# Altium schematic sheet MEZ_ALL_IND.SchDoc
size A4
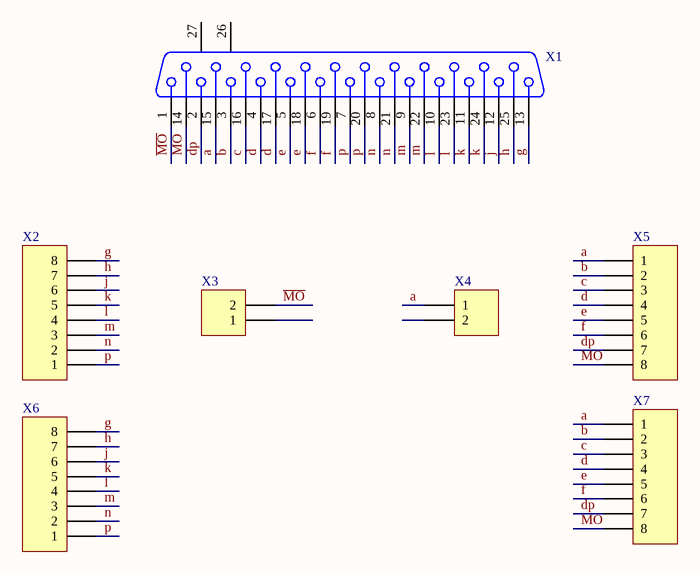
[diagram p0: MEZ_ALL_IND.SchDoc]

## Parts
X1  D Connector 25  [DSUB1.385-2H25A]  (value not drawn)
X2  Header 8  [HDR1X8]  (value not drawn)
X3  Header 2  [HDR1X2]  (value not drawn)
X4  Header 2  [HDR1X2]  (value not drawn)
X5  Header 8  [HDR1X8]  (value not drawn)
X6  Header 8  [HDR1X8]  (value not drawn)
X7  Header 8  [HDR1X8]  (value not drawn)

## Nets
~{MO}: X1.1 X1.14 X3.2 X5.8 X7.8
a: X1.15 X4.1 X5.1 X7.1
b: X1.3 X5.2 X7.2
c: X1.16 X5.3 X7.3
d: X1.4 X1.17 X5.4 X7.4
dp: X1.2 X5.7 X7.7
e: X1.5 X1.18 X5.5 X7.5
f: X1.6 X1.19 X5.6 X7.6
g: X1.13 X2.8 X6.8
h: X1.25 X2.7 X6.7
j: X1.12 X2.6 X6.6
k: X1.11 X1.24 X2.5 X6.5
l: X1.10 X1.23 X2.4 X6.4
m: X1.9 X1.22 X2.3 X6.3
n: X1.8 X1.21 X2.2 X6.2
p: X1.7 X1.20 X2.1 X6.1

Not connected (* = marked no-connect by the designer): X1 26(MH1) 27(MH2); X3 1; X4 2

## Library data of the parts
X1 = D Connector 25: Receptacle Assembly, 25 Position, Right Angle; PackageDocument: U; Positions: 25; Published: 15-Jun-2001; LatestRevisionDate: 17-Jul-2002; LatestRevisionNote: Re-released for DXP Platform.; DatasheetDocument: 19-Mar-1999; PackageReference: 787202; Publisher: Altium Limited; Orientation: Right Angle; Gender: Receptacle
X2 X5-X7 = Header 8: Header, 8-Pin; LatestRevisionDate: 17-Jul-2002; LatestRevisionNote: Re-released for DXP Platform.; Publisher: Altium Limited
X3 X4 = Header 2: Header, 2-Pin; LatestRevisionDate: 17-Jul-2002; LatestRevisionNote: Re-released for DXP Platform.; Publisher: Altium Limited